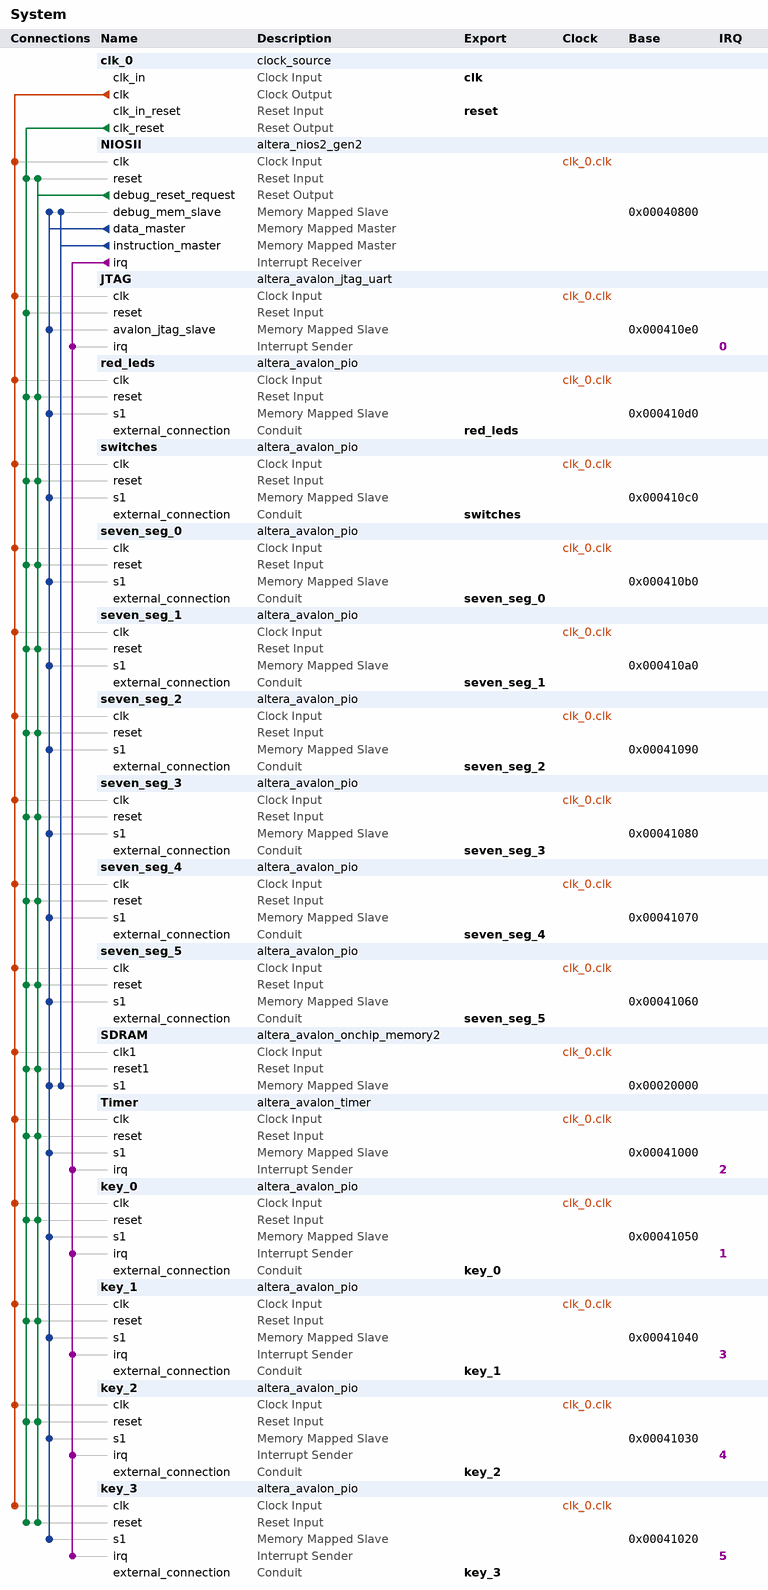
[diagram p0: system contents]
# Platform Designer (Qsys) system System, Cyclone V 5CSEMA5F31C6
# Parameters at their usual value, and those the tool derives, are not listed.
package require -exact qsys 18.1
create_system System
set_project_property DEVICE_FAMILY {Cyclone V}
set_project_property DEVICE 5CSEMA5F31C6

add_instance clk_0 clock_source 18.1
set_instance_parameter_value clk_0 clockFrequency 50000000

add_instance NIOSII altera_nios2_gen2 18.1
set_instance_parameter_value NIOSII dcache_size 2048
set_instance_parameter_value NIOSII exceptionSlave SDRAM.s1
set_instance_parameter_value NIOSII icache_size 4096
set_instance_parameter_value NIOSII impl Fast
set_instance_parameter_value NIOSII resetSlave SDRAM.s1

add_instance JTAG altera_avalon_jtag_uart 18.1
set_instance_parameter_value JTAG simInteractiveOptions NO_INTERACTIVE_WINDOWS

add_instance red_leds altera_avalon_pio 18.1
set_instance_parameter_value red_leds direction Output
set_instance_parameter_value red_leds width 10

add_instance switches altera_avalon_pio 18.1
set_instance_parameter_value switches direction Input
set_instance_parameter_value switches width 10

add_instance seven_seg_0 altera_avalon_pio 18.1
set_instance_parameter_value seven_seg_0 direction Output
set_instance_parameter_value seven_seg_0 width 7

add_instance seven_seg_1 altera_avalon_pio 18.1
set_instance_parameter_value seven_seg_1 direction Output
set_instance_parameter_value seven_seg_1 width 7

add_instance seven_seg_2 altera_avalon_pio 18.1
set_instance_parameter_value seven_seg_2 direction Output
set_instance_parameter_value seven_seg_2 width 7

add_instance seven_seg_3 altera_avalon_pio 18.1
set_instance_parameter_value seven_seg_3 direction Output
set_instance_parameter_value seven_seg_3 width 7

add_instance seven_seg_4 altera_avalon_pio 18.1
set_instance_parameter_value seven_seg_4 direction Output
set_instance_parameter_value seven_seg_4 width 7

add_instance seven_seg_5 altera_avalon_pio 18.1
set_instance_parameter_value seven_seg_5 direction Output
set_instance_parameter_value seven_seg_5 width 7

add_instance SDRAM altera_avalon_onchip_memory2 18.1
set_instance_parameter_value SDRAM dataWidth 32
set_instance_parameter_value SDRAM dualPort false
set_instance_parameter_value SDRAM initMemContent true
set_instance_parameter_value SDRAM initializationFileName onchip_mem.hex
set_instance_parameter_value SDRAM memorySize 81960

add_instance Timer altera_avalon_timer 18.1
set_instance_parameter_value Timer period 1
set_instance_parameter_value Timer periodUnits MSEC

add_instance key_0 altera_avalon_pio 18.1
set_instance_parameter_value key_0 captureEdge true
set_instance_parameter_value key_0 direction Input
set_instance_parameter_value key_0 edgeType FALLING
set_instance_parameter_value key_0 generateIRQ true
set_instance_parameter_value key_0 width 1

add_instance key_1 altera_avalon_pio 18.1
set_instance_parameter_value key_1 captureEdge true
set_instance_parameter_value key_1 direction Input
set_instance_parameter_value key_1 edgeType FALLING
set_instance_parameter_value key_1 generateIRQ true
set_instance_parameter_value key_1 width 1

add_instance key_2 altera_avalon_pio 18.1
set_instance_parameter_value key_2 captureEdge true
set_instance_parameter_value key_2 direction Input
set_instance_parameter_value key_2 edgeType FALLING
set_instance_parameter_value key_2 generateIRQ true
set_instance_parameter_value key_2 width 1

add_instance key_3 altera_avalon_pio 18.1
set_instance_parameter_value key_3 captureEdge true
set_instance_parameter_value key_3 direction Input
set_instance_parameter_value key_3 edgeType FALLING
set_instance_parameter_value key_3 generateIRQ true
set_instance_parameter_value key_3 width 1

# connections
add_connection clk_0.clk JTAG.clk clock
add_connection clk_0.clk key_0.clk clock
add_connection clk_0.clk key_1.clk clock
add_connection clk_0.clk key_2.clk clock
add_connection clk_0.clk key_3.clk clock
add_connection clk_0.clk NIOSII.clk clock
add_connection clk_0.clk red_leds.clk clock
add_connection clk_0.clk SDRAM.clk1 clock
add_connection clk_0.clk seven_seg_0.clk clock
add_connection clk_0.clk seven_seg_1.clk clock
add_connection clk_0.clk seven_seg_2.clk clock
add_connection clk_0.clk seven_seg_3.clk clock
add_connection clk_0.clk seven_seg_4.clk clock
add_connection clk_0.clk seven_seg_5.clk clock
add_connection clk_0.clk switches.clk clock
add_connection clk_0.clk Timer.clk clock
add_connection clk_0.clk_reset JTAG.reset reset
add_connection clk_0.clk_reset key_0.reset reset
add_connection clk_0.clk_reset key_1.reset reset
add_connection clk_0.clk_reset key_2.reset reset
add_connection clk_0.clk_reset key_3.reset reset
add_connection clk_0.clk_reset NIOSII.reset reset
add_connection clk_0.clk_reset red_leds.reset reset
add_connection clk_0.clk_reset SDRAM.reset1 reset
add_connection clk_0.clk_reset seven_seg_0.reset reset
add_connection clk_0.clk_reset seven_seg_1.reset reset
add_connection clk_0.clk_reset seven_seg_2.reset reset
add_connection clk_0.clk_reset seven_seg_3.reset reset
add_connection clk_0.clk_reset seven_seg_4.reset reset
add_connection clk_0.clk_reset seven_seg_5.reset reset
add_connection clk_0.clk_reset switches.reset reset
add_connection clk_0.clk_reset Timer.reset reset
add_connection NIOSII.debug_reset_request key_0.reset reset
add_connection NIOSII.debug_reset_request key_1.reset reset
add_connection NIOSII.debug_reset_request key_2.reset reset
add_connection NIOSII.debug_reset_request key_3.reset reset
add_connection NIOSII.debug_reset_request NIOSII.reset reset
add_connection NIOSII.debug_reset_request red_leds.reset reset
add_connection NIOSII.debug_reset_request SDRAM.reset1 reset
add_connection NIOSII.debug_reset_request seven_seg_0.reset reset
add_connection NIOSII.debug_reset_request seven_seg_1.reset reset
add_connection NIOSII.debug_reset_request seven_seg_2.reset reset
add_connection NIOSII.debug_reset_request seven_seg_3.reset reset
add_connection NIOSII.debug_reset_request seven_seg_4.reset reset
add_connection NIOSII.debug_reset_request seven_seg_5.reset reset
add_connection NIOSII.debug_reset_request switches.reset reset
add_connection NIOSII.debug_reset_request Timer.reset reset
add_connection NIOSII.data_master JTAG.avalon_jtag_slave avalon
set_connection_parameter_value NIOSII.data_master/JTAG.avalon_jtag_slave baseAddress 0x000410e0
add_connection NIOSII.data_master key_0.s1 avalon
set_connection_parameter_value NIOSII.data_master/key_0.s1 baseAddress 0x00041050
add_connection NIOSII.data_master key_1.s1 avalon
set_connection_parameter_value NIOSII.data_master/key_1.s1 baseAddress 0x00041040
add_connection NIOSII.data_master key_2.s1 avalon
set_connection_parameter_value NIOSII.data_master/key_2.s1 baseAddress 0x00041030
add_connection NIOSII.data_master key_3.s1 avalon
set_connection_parameter_value NIOSII.data_master/key_3.s1 baseAddress 0x00041020
add_connection NIOSII.data_master NIOSII.debug_mem_slave avalon
set_connection_parameter_value NIOSII.data_master/NIOSII.debug_mem_slave baseAddress 0x00040800
add_connection NIOSII.data_master red_leds.s1 avalon
set_connection_parameter_value NIOSII.data_master/red_leds.s1 baseAddress 0x000410d0
add_connection NIOSII.data_master SDRAM.s1 avalon
set_connection_parameter_value NIOSII.data_master/SDRAM.s1 baseAddress 0x00020000
add_connection NIOSII.data_master seven_seg_0.s1 avalon
set_connection_parameter_value NIOSII.data_master/seven_seg_0.s1 baseAddress 0x000410b0
add_connection NIOSII.data_master seven_seg_1.s1 avalon
set_connection_parameter_value NIOSII.data_master/seven_seg_1.s1 baseAddress 0x000410a0
add_connection NIOSII.data_master seven_seg_2.s1 avalon
set_connection_parameter_value NIOSII.data_master/seven_seg_2.s1 baseAddress 0x00041090
add_connection NIOSII.data_master seven_seg_3.s1 avalon
set_connection_parameter_value NIOSII.data_master/seven_seg_3.s1 baseAddress 0x00041080
add_connection NIOSII.data_master seven_seg_4.s1 avalon
set_connection_parameter_value NIOSII.data_master/seven_seg_4.s1 baseAddress 0x00041070
add_connection NIOSII.data_master seven_seg_5.s1 avalon
set_connection_parameter_value NIOSII.data_master/seven_seg_5.s1 baseAddress 0x00041060
add_connection NIOSII.data_master switches.s1 avalon
set_connection_parameter_value NIOSII.data_master/switches.s1 baseAddress 0x000410c0
add_connection NIOSII.data_master Timer.s1 avalon
set_connection_parameter_value NIOSII.data_master/Timer.s1 baseAddress 0x00041000
add_connection NIOSII.instruction_master NIOSII.debug_mem_slave avalon
set_connection_parameter_value NIOSII.instruction_master/NIOSII.debug_mem_slave baseAddress 0x00040800
add_connection NIOSII.instruction_master SDRAM.s1 avalon
set_connection_parameter_value NIOSII.instruction_master/SDRAM.s1 baseAddress 0x00020000
add_connection NIOSII.irq JTAG.irq interrupt
set_connection_parameter_value NIOSII.irq/JTAG.irq irqNumber 0
add_connection NIOSII.irq key_0.irq interrupt
set_connection_parameter_value NIOSII.irq/key_0.irq irqNumber 1
add_connection NIOSII.irq key_1.irq interrupt
set_connection_parameter_value NIOSII.irq/key_1.irq irqNumber 3
add_connection NIOSII.irq key_2.irq interrupt
set_connection_parameter_value NIOSII.irq/key_2.irq irqNumber 4
add_connection NIOSII.irq key_3.irq interrupt
set_connection_parameter_value NIOSII.irq/key_3.irq irqNumber 5
add_connection NIOSII.irq Timer.irq interrupt
set_connection_parameter_value NIOSII.irq/Timer.irq irqNumber 2

# exported interfaces
add_interface clk clock sink
set_interface_property clk EXPORT_OF clk_0.clk_in
add_interface key_0 conduit end
set_interface_property key_0 EXPORT_OF key_0.external_connection
add_interface key_1 conduit end
set_interface_property key_1 EXPORT_OF key_1.external_connection
add_interface key_2 conduit end
set_interface_property key_2 EXPORT_OF key_2.external_connection
add_interface key_3 conduit end
set_interface_property key_3 EXPORT_OF key_3.external_connection
add_interface red_leds conduit end
set_interface_property red_leds EXPORT_OF red_leds.external_connection
add_interface reset reset sink
set_interface_property reset EXPORT_OF clk_0.clk_in_reset
add_interface seven_seg_0 conduit end
set_interface_property seven_seg_0 EXPORT_OF seven_seg_0.external_connection
add_interface seven_seg_1 conduit end
set_interface_property seven_seg_1 EXPORT_OF seven_seg_1.external_connection
add_interface seven_seg_2 conduit end
set_interface_property seven_seg_2 EXPORT_OF seven_seg_2.external_connection
add_interface seven_seg_3 conduit end
set_interface_property seven_seg_3 EXPORT_OF seven_seg_3.external_connection
add_interface seven_seg_4 conduit end
set_interface_property seven_seg_4 EXPORT_OF seven_seg_4.external_connection
add_interface seven_seg_5 conduit end
set_interface_property seven_seg_5 EXPORT_OF seven_seg_5.external_connection
add_interface switches conduit end
set_interface_property switches EXPORT_OF switches.external_connection

set_interconnect_requirement {$system} qsys_mm.clockCrossingAdapter HANDSHAKE
set_interconnect_requirement {$system} qsys_mm.enableEccProtection FALSE
set_interconnect_requirement {$system} qsys_mm.insertDefaultSlave FALSE
set_interconnect_requirement {$system} qsys_mm.maxAdditionalLatency 1

save_system System.qsys
